# EAGLE design TSAL (EAGLE 6.6.0)
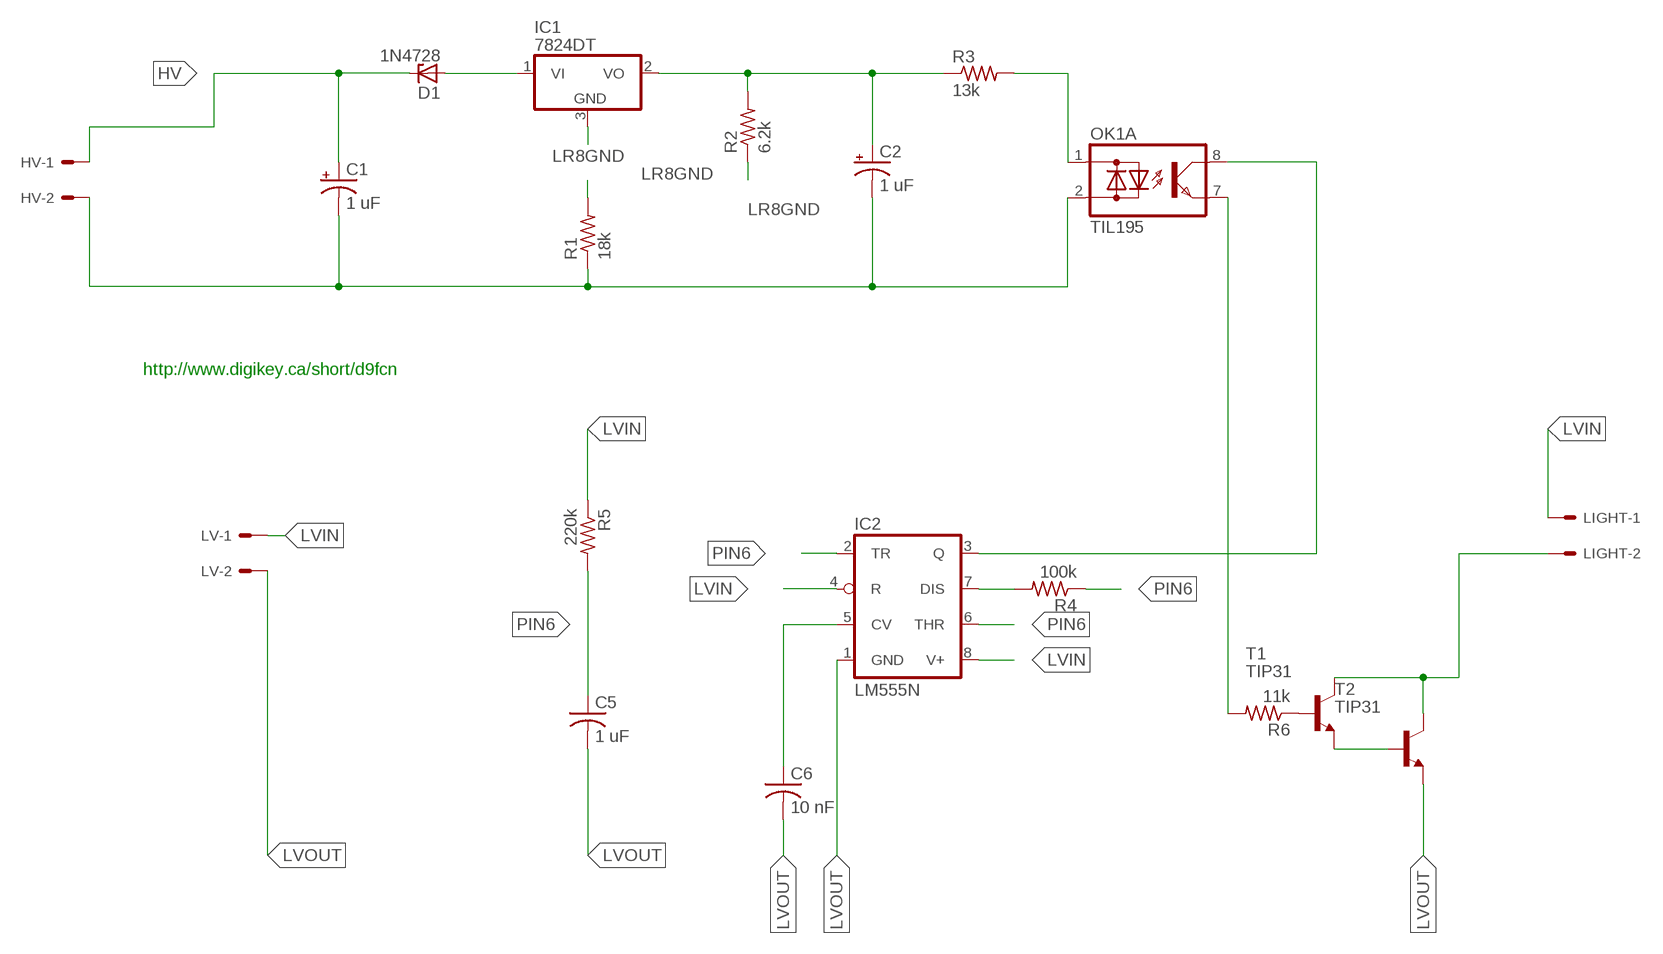
[diagram p0: schematic, sheet 1]

## Parts
C1  1 uF  CPOL-USE2.5-7  [E2,5-7]
C2  1 uF  CPOL-USE2.5-7  [E2,5-7]
C5  1 uF  C-US050-035X075  [C050-035X075]
C6  10 nF  C-US025-025X050  [C025-025X050]
D1  1N4728  [DO41Z10]
HV  KK-156-2  [KK-156-2]
IC1  7824DT  [TO252]
IC2  LM555N  [DIL08-ROUND]
LIGHT  KK-156-2  [KK-156-2]
LV  KK-156-2  [KK-156-2]
OK1  TIL195  [DIL08]
R1  18k  R-US_0617/22  [0617/22]
R2  6.2k  R-US_0617/22  [0617/22]
R3  13k  R-US_0617/17  [0617/17]
R4  100k  R-US_0207/7  [0207/7]
R5  220k  R-US_0207/7  [0207/7]
R6  11k  R-US_0411/12  [0411/12]
T1  TIP31  [TO220]
T2  TIP31  [TO220]

## Nets
HV [HV]: C1.+ D1.C HV.1
LR8GND [HV]: IC1.3(GND) R1.2 R2.1
LVIN: IC2.4(R) IC2.8(V+) LIGHT.1 LV.1 R5.1
LVOUT: C5.2 C6.2 IC2.1(GND) LV.2 T2.3(E)
N$1 [HV]: D1.A IC1.1(VI)
N$2 [HV]: C2.+ IC1.2(VO) R2.2 R3.1
N$4 [HV]: C1.- C2.- HV.2 OK1.2(A:AC2) R1.1
N$6: IC2.7(DIS) R4.2
N$7: LIGHT.2 T1.2(C) T2.2(C)
N$8: T1.3(E) T2.1(B)
N$9 [HV]: OK1.1(A:AC1) R3.2
N$10: C6.1 IC2.5(CV)
N$12: IC2.3(Q) OK1.8(A:C)
N$13: OK1.7(A:E) R6.2
N$14: R6.1 T1.1(B)
PIN6: C5.1 IC2.2(TR) IC2.6(THR) R4.1 R5.2
Unconnected: OK1.3(B:AC1) OK1.4(B:AC2) OK1.5(B:E) OK1.6(B:C)

## Notes on the sheet
- http://www.digikey.ca/short/d9fcn

## Library data of the parts
C1 C2 = adafruit:CPOL-US: POLARIZED CAPACITOR, American symbol
C5 C6 = adafruit:C-US: CAPACITOR, American symbol
D1 = diode:1N4728: Z DIODE 3.3 V, 1W, 5 percent
HV LIGHT LV = con-molex:KK-156-2: KK 156 HEADER Source: http://www.molex.com/pdm_docs/sd/026604100_sd.pdf; OC_FARNELL: unknown; OC_NEWARK: unknown
IC1 = linear:78*: Positive VOLTAGE REGULATOR Source: http://cache.national.com/ds/LM/LM78L05.pdf http://www.fairchildsemi.com/ds/LM/LM7805.pdf
IC2 = adafruit:*555: TIMER Changed DIP package to have round (not oval) pin pads http://www.ladyada.net/library/pcb/eaglelibrary.html
OK1 = optocoupler:TIL195: TEXAS INSTRUMENTS OPTO COUPLER; OC_FARNELL: unknown; OC_NEWARK: unknown
R1-R6 = adafruit:R-US_: RESISTOR, American symbol
T1 T2 = transistor:TIP31: NPN Transistor Medium Power Linear Switching Applications Source: http://onsemi.com

## Net classes
0 LV: width 0.305 mm, drill 0.508 mm, clearance 0.254 mm
1 HV: width 1.27 mm, drill 1.27 mm, clearance 2.54 mm

## Board
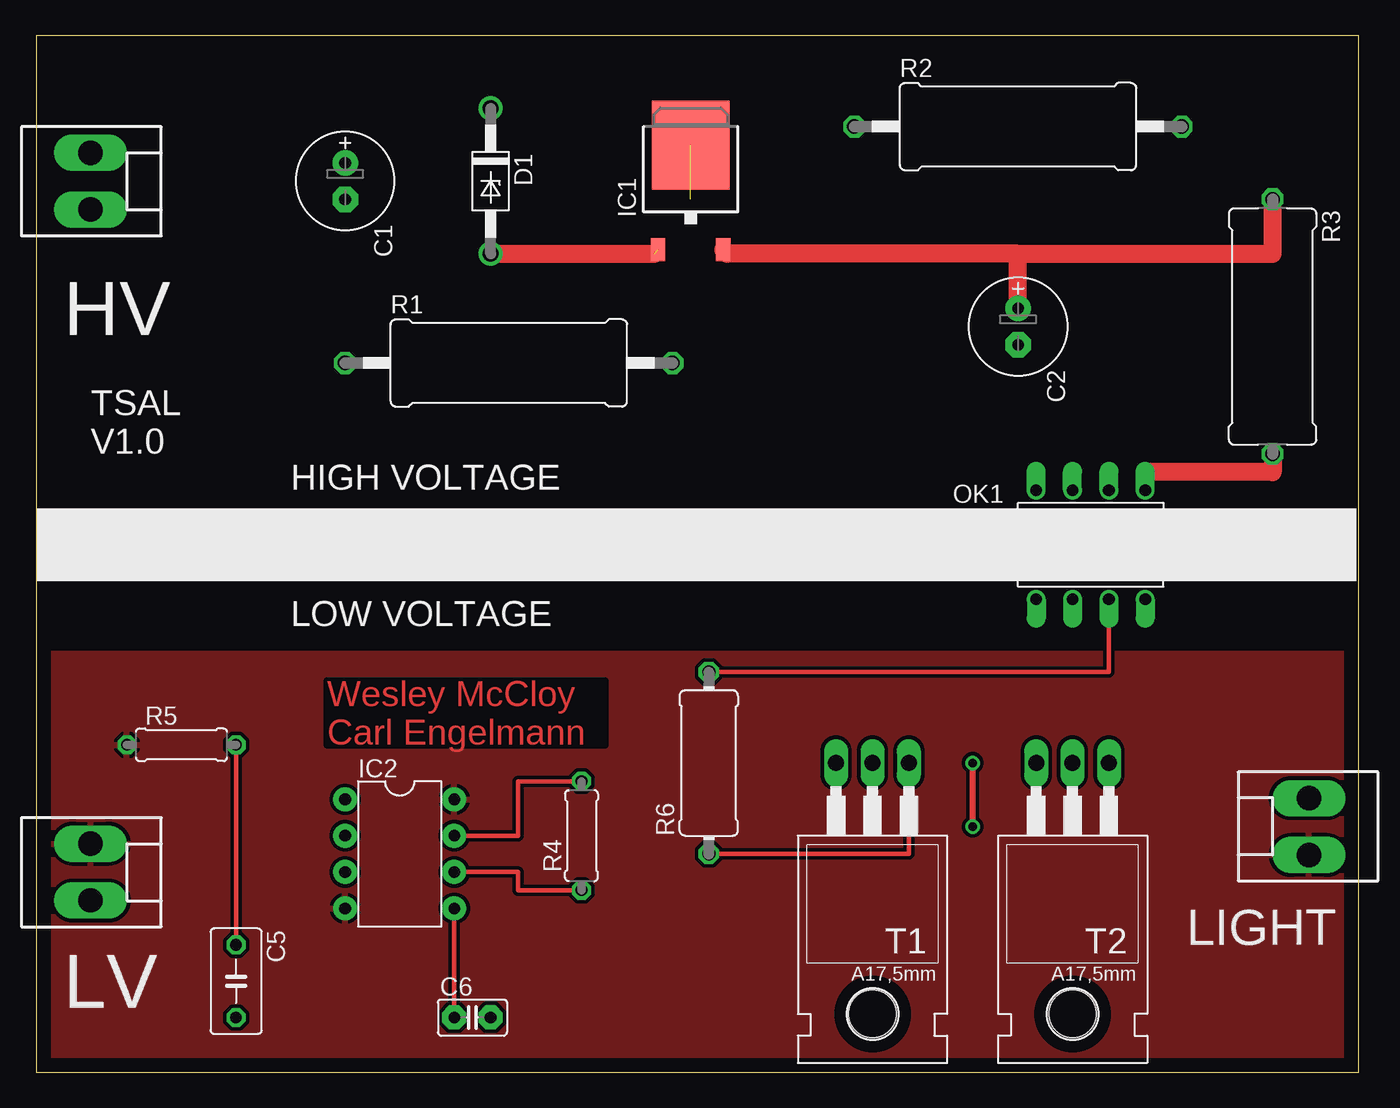
[diagram p1: board, top side]
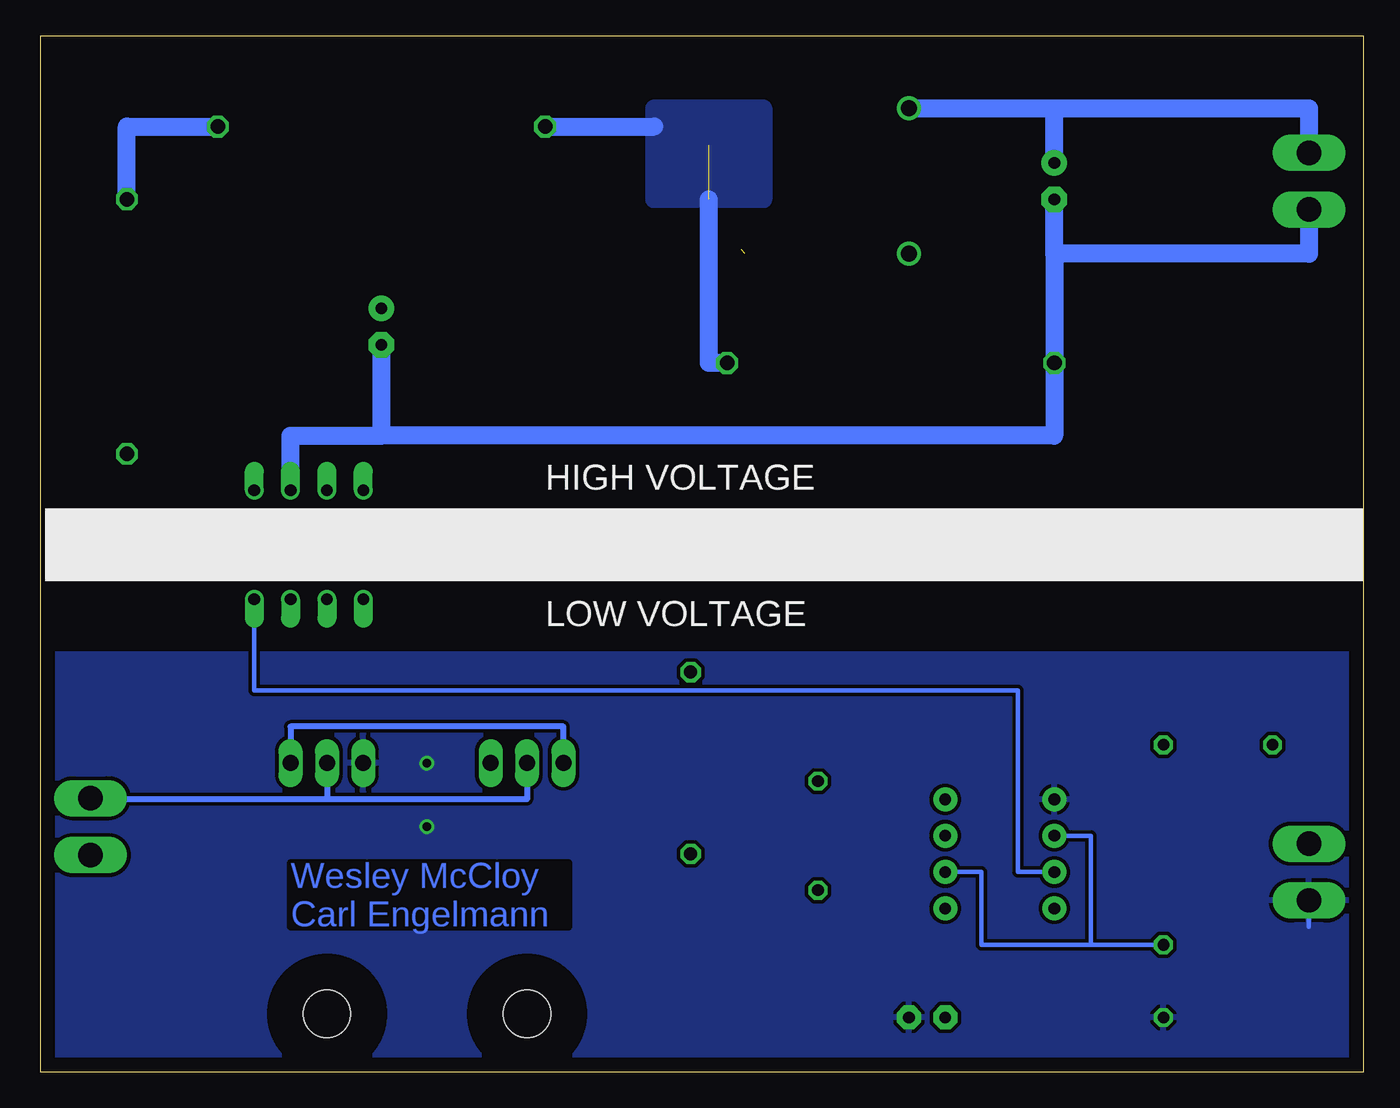
[diagram p2: board, bottom side, seen from below]

Size 92.38 x 72.38 mm. Coordinates in mm from the lower left corner, seen from the top.
Outline: 0,0 92.38,0 92.38,72.38 0,72.38 0,0
Copper layers (1*16): Top 0.035mm / dielectric 1.5mm / Bottom 0.035mm
Design rules "default": minimum track width 10mil, minimum drill 24mil, track to track 8mil, track to pad 8mil, pad to pad 8mil, via to via 8mil, smd to smd 8mil, copper to edge 40mil, drill to drill 8mil, minimum pad ring 10mil, minimum via ring 8mil, stop-mask expansion 4mil, vias tented up to drill 0mil, thermal gap 10mil

### Footprints (pad centres in the part's own frame; a part is rotated, then mirrored left to right if it is on the bottom)
E2,5-7 = drill 0.813 pad 1.778: + -1.27,0 | drill 0.813 pad 1.778 octagon: - 1.27,0
C050-035X075 = drill 0.813 octagon: 1 -2.54,0; 2 2.54,0
C025-025X050 = drill 0.813 pad 1.676 octagon: 1 -1.27,0; 2 1.27,0
DO41Z10 = drill 1.118: A 5.08,0; C -5.08,0
KK-156-2 = drill 1.7 pad 2.184 long: 1 -1.98,0; 2 1.98,0
TO252 = smd 1 x 1.6: 1 -2.28,-4.8; 2 2.28,-4.8 | smd 5.4 x 6.2: 3 0,2.5
DIL08-ROUND = drill 0.813 pad 1.676: 1 -3.81,-3.81; 2 -1.27,-3.81; 3 1.27,-3.81; 4 3.81,-3.81; 5 3.81,3.81; 6 1.27,3.81; 7 -1.27,3.81; 8 -3.81,3.81
DIL08 = drill 0.813 offset: 1 -3.81,-3.81; 2 -1.27,-3.81; 3 1.27,-3.81; 4 3.81,-3.81; 5 3.81,3.81; 6 1.27,3.81; 7 -1.27,3.81; 8 -3.81,3.81
0617/22 = drill 1.016 octagon: 1 -11.43,0; 2 11.43,0
0617/17 = drill 1.016 octagon: 1 -8.89,0; 2 8.89,0
0207/7 = drill 0.813 octagon: 1 -3.81,0; 2 3.81,0
0411/12 = drill 0.914 octagon: 1 -6.35,0; 2 6.35,0
TO220 = drill 1.118 long: 1 -2.54,-6.35; 2 0,-6.35; 3 2.54,-6.35 | hole 3.302: 0,11.176

### Placement (x,y rotation side)
C1  21.59,62.23 270 top
C2  68.58,52.07 270 top
C5  13.97,6.35 270 top
C6  30.48,3.81 0 top
D1  31.75,62.23 270 top
HV  3.81,62.23 270 top
IC1  45.72,62.23 0 top
IC2  25.4,15.24 270 top
LIGHT  88.9,17.14 90 top
LV  3.81,13.97 270 top
OK1  73.66,36.83 180 top
R1  33.02,49.53 0 top
R2  68.58,66.04 0 top
R3  86.36,52.07 270 top
R4  38.1,16.51 90 top
R5  10.16,22.86 0 top
R6  46.99,21.59 90 top
T1  58.42,15.24 180 top
T2  72.39,15.24 180 top

### Tracks (layer width: path | path; a pad name or v marks a point on that pad's centre or on a via)
HV
  Bottom 1.27: D1.C 21.59,67.31 | HV.1 3.81,67.31 21.59,67.31 | C1.+ 21.59,67.31
LR8GND  (1 unrouted)
  Bottom 1.27: R1.2 45.72,49.53 45.72,60.96 | R2.1 49.53,66.04
  pour Bottom: 41.91,67.31 41.91,60.96 49.53,60.96 49.53,67.31
LVIN
  pour Top: -2.54,29.21 -2.54,-2.54 102.87,-2.54 102.87,29.21
LVOUT  (via drill 0.6)
  Top 0.406: v65.41,21.59 v65.41,17.14
  Bottom 0.305: 3.81,10.16 LV.2
  pour Bottom: -1.27,29.21 -1.27,-1.27 101.6,-1.27 101.6,29.21
N$1  (1 unrouted)
  Top 1.27: D1.A 43.18,57.15
N$2
  Top 1.27: 68.58,57.15 48.26,57.15 IC1.2 | C2.+ 68.58,57.15 | 68.58,57.15 86.36,57.15 R3.1
  Bottom 1.27: R2.2 86.36,66.04 R3.1
N$4
  Bottom 1.27: HV.2 3.81,57.15 21.59,57.15 | 21.59,57.15 C1.- | 68.58,44.45 74.93,44.45 OK1.2 | 68.58,44.45 C2.- | 68.58,44.45 21.59,44.45 R1.1 21.59,57.15
N$6
  Top 0.305: IC2.7 33.66,16.51 33.66,20.32 R4.2
N$7
  Bottom 0.406: T2.2 72.39,19.05 | 72.39,19.05 88.9,19.05 LIGHT.2 | T1.2 58.42,19.05 72.39,19.05
N$8
  Bottom 0.406: T1.3 55.88,24.13 74.93,24.13 T2.1
N$9
  Top 1.27: R3.2 86.36,41.91 77.47,41.91 OK1.1
N$10
  Top 0.305: IC2.5 C6.1
N$12
  Bottom 0.305: OK1.8 77.47,26.67 24.13,26.67 24.13,13.97 IC2.3
N$13
  Top 0.305: OK1.7 74.93,27.94 R6.2
N$14
  Top 0.305: R6.1 60.96,15.24 T1.1
PIN6
  Top 0.305: C5.1 R5.2 | IC2.6 33.66,13.97 33.66,12.7 R4.1
  Bottom 0.305: 19.05,8.89 19.05,16.51 IC2.2 | IC2.6 26.67,13.97 26.67,8.89 19.05,8.89 | 19.05,8.89 C5.1

### Text on the board
Top: Wesley McCloy / Carl Engelmann
Bottom: Wesley McCloy / Carl Engelmann
_tsilk: TSAL / V1.0 | HIGH VOLTAGE | LOW VOLTAGE
_bsilk: HIGH VOLTAGE | LOW VOLTAGE